# Altium schematic sheet Motor.SchDoc
size A
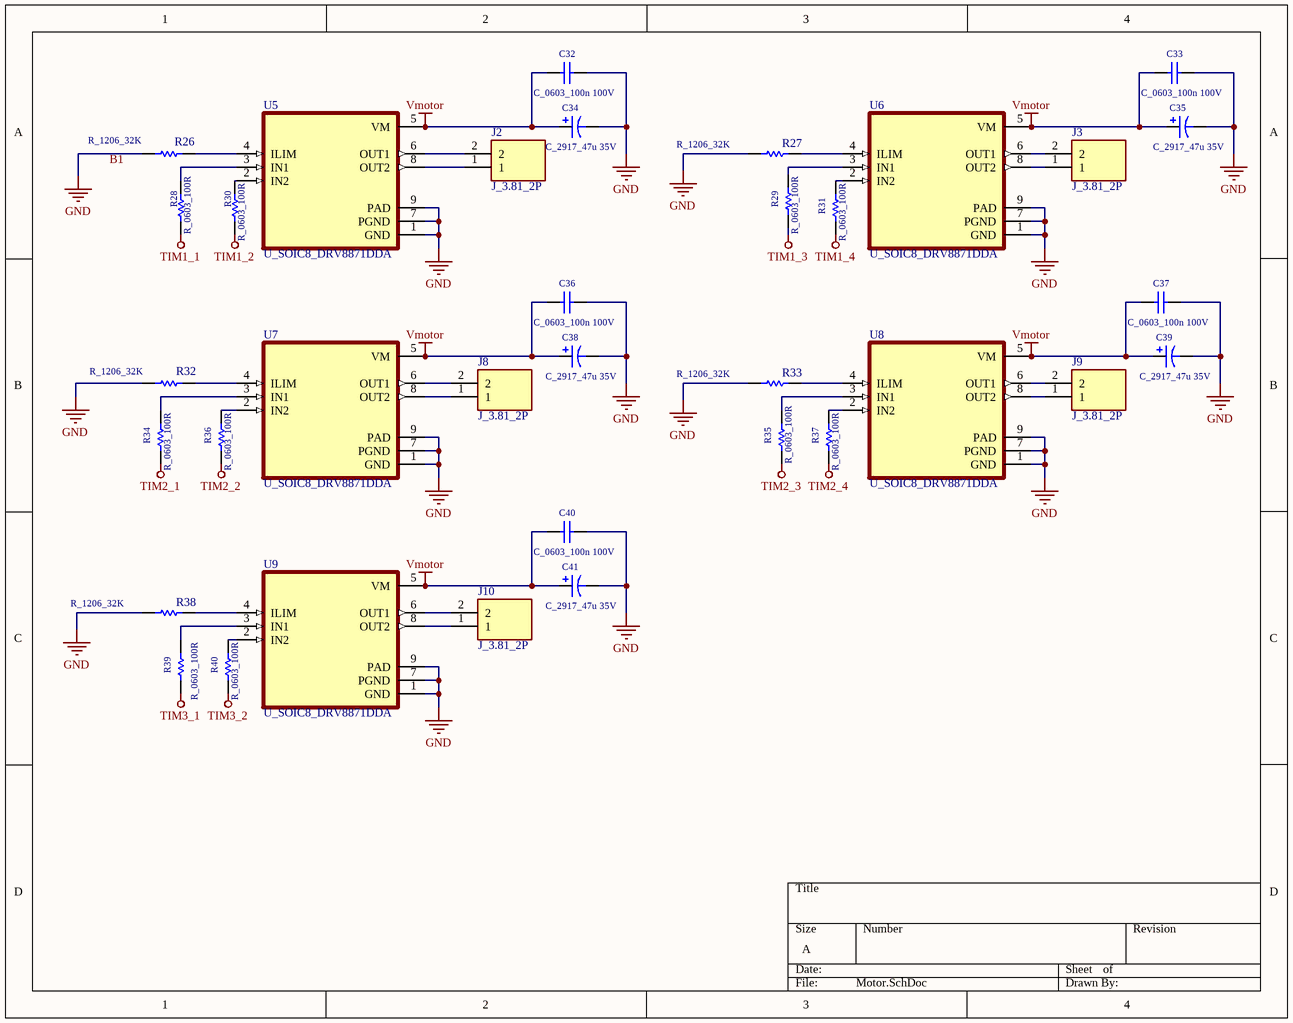
[diagram p0: Motor.SchDoc]

## Parts
C32  C_0603_100n 100V  [CAP 0603]
C33  C_0603_100n 100V  [CAP 0603]
C34  C_2917_47u 35V  [CAP 2917 TAN]
C35  C_2917_47u 35V  [CAP 2917 TAN]
C36  C_0603_100n 100V  [CAP 0603]
C37  C_0603_100n 100V  [CAP 0603]
C38  C_2917_47u 35V  [CAP 2917 TAN]
C39  C_2917_47u 35V  [CAP 2917 TAN]
C40  C_0603_100n 100V  [CAP 0603]
C41  C_2917_47u 35V  [CAP 2917 TAN]
J2  J_3.81_2P  [2 Pin PCB TB 3.81]
J3  J_3.81_2P  [2 Pin PCB TB 3.81]
J8  J_3.81_2P  [2 Pin PCB TB 3.81]
J9  J_3.81_2P  [2 Pin PCB TB 3.81]
J10  J_3.81_2P  [2 Pin PCB TB 3.81]
R26  R_1206_32K  [RES 1206]
R27  R_1206_32K  [RES 1206]
R28  R_0603_100R  [RES 0603]
R29  R_0603_100R  [RES 0603]
R30  R_0603_100R  [RES 0603]
R31  R_0603_100R  [RES 0603]
R32  R_1206_32K  [RES 1206]
R33  R_1206_32K  [RES 1206]
R34  R_0603_100R  [RES 0603]
R35  R_0603_100R  [RES 0603]
R36  R_0603_100R  [RES 0603]
R37  R_0603_100R  [RES 0603]
R38  R_1206_32K  [RES 1206]
R39  R_0603_100R  [RES 0603]
R40  R_0603_100R  [RES 0603]
U5  U_SOIC8_DRV8871DDA  [SOIC8]
U6  U_SOIC8_DRV8871DDA  [SOIC8]
U7  U_SOIC8_DRV8871DDA  [SOIC8]
U8  U_SOIC8_DRV8871DDA  [SOIC8]
U9  U_SOIC8_DRV8871DDA  [SOIC8]

## Nets
GND: C32.2 C33.2 C34.2 C35.2 C36.2 C37.2 C38.2 C39.2 C40.2 C41.2 R26.1 R27.1 R32.1 R33.1 R38.1 U5.1(GND) U5.7(PGND) U5.9(PAD) U6.1(GND) U6.7(PGND) U6.9(PAD) U7.1(GND) U7.7(PGND) U7.9(PAD) U8.1(GND) U8.7(PGND) U8.9(PAD) U9.1(GND) U9.7(PGND) U9.9(PAD)
TIM1_1: R28.1
TIM1_2: R30.1
TIM1_3: R29.1
TIM1_4: R31.1
TIM2_1: R34.1
TIM2_2: R36.1
TIM2_3: R35.1
TIM2_4: R37.1
TIM3_1: R39.1
TIM3_2: R40.1
Vmotor: C32.1 C33.1 C34.1 C35.1 C36.1 C37.1 C38.1 C39.1 C40.1 C41.1 U5.5(VM) U6.5(VM) U7.5(VM) U8.5(VM) U9.5(VM)
NetJ2_1: J2.1 U5.8(OUT2)
NetJ2_2: J2.2 U5.6(OUT1)
NetJ3_1: J3.1 U6.8(OUT2)
NetJ3_2: J3.2 U6.6(OUT1)
NetJ8_1: J8.1 U7.8(OUT2)
NetJ8_2: J8.2 U7.6(OUT1)
NetJ9_1: J9.1 U8.8(OUT2)
NetJ9_2: J9.2 U8.6(OUT1)
NetJ10_1: J10.1 U9.8(OUT2)
NetJ10_2: J10.2 U9.6(OUT1)
NetR26_2: R26.2 U5.4(ILIM)
NetR27_2: R27.2 U6.4(ILIM)
NetR28_2: R28.2 U5.3(IN1)
NetR29_2: R29.2 U6.3(IN1)
NetR30_2: R30.2 U5.2(IN2)
NetR31_2: R31.2 U6.2(IN2)
NetR32_2: R32.2 U7.4(ILIM)
NetR33_2: R33.2 U8.4(ILIM)
NetR34_2: R34.2 U7.3(IN1)
NetR35_2: R35.2 U8.3(IN1)
NetR36_2: R36.2 U7.2(IN2)
NetR37_2: R37.2 U8.2(IN2)
NetR38_2: R38.2 U9.4(ILIM)
NetR39_2: R39.2 U9.3(IN1)
NetR40_2: R40.2 U9.2(IN2)

## Notes on the sheet
- Labels drawn without touching a wire or pin: B1

## Library data of the parts
C32 C33 C36 C37 C40 = Cap: Capacitor; Published: 8-Jun-2000; LatestRevisionDate: 17-Jul-2002; LatestRevisionNote: Re-released for DXP Platform.; Publisher: Altium Limited
C34 C35 C38 C39 C41 = Cap Tantalium: Capacitor Tantalium; Published: 8-Jun-2000; LatestRevisionDate: 17-Jul-2002; LatestRevisionNote: Re-released for DXP Platform.; Publisher: Altium Limited
J2 J3 J8-J10 = 2 Pin PCB Terminal Block: MF: CUI Devices; MP: TBP02R1-381-02BE; CUI_purchase_URL: https://www.cuidevices.com/product/interconnect/connectors/terminal-blocks/tbp02r1-381-series?utm_source=snapeda.com&utm_medium=referral&utm_campaign=snapedaBOM; Purchase-URL: https://pricing.snapeda.com/search/part/TBP02R1-381-02BE/?ref=eda; Price: None; SnapEDA_Link: https://www.snapeda.com/parts/TBP02R1-381-02BE/CUI+Devices/view-part/?ref=snap; Check_prices: https://www.snapeda.com/parts/TBP02R1-381-02BE/CUI+Devices/view-part/?ref=eda; Package: None; Availability: In Stock; Value: *
R26-R40 = Res: Resistor; Published: 8-Jun-2000; LatestRevisionDate: 17-Jul-2002; LatestRevisionNote: Re-released for DXP Platform.; Publisher: Altium Limited
U5-U9 = DRV8871DDA: 45-V, 3.6-A H-bridge motor driver with integrated current sensing 8-SO PowerPAD -40 to 125; MF: Texas Instruments; Mouser-Purchase-URL: https://snapeda.com/shop?store=Mouser&id=547750; SnapEDA_Link: https://www.snapeda.com/parts/DRV8871DDA/Texas%20Instruments/view-part/547750/?ref=snap; DigiKey-Purchase-URL: https://snapeda.com/shop?store=DigiKey&id=547750; Arrow_Electronics-Purchase-URL: https://snapeda.com/shop?store=Arrow+Electronics&id=547750; MP: DRV8871DDA; Texas_Instruments-Purchase-URL: https://snapeda.com/shop?store=Texas+Instruments&id=547750; Availability: Good; Price: None; Value: *; Package: HSOIC-8 Texas Instruments; BuyPart: https://www.snapeda.com/parts/DRV8871DDA/Texas%20Instruments/view-part/547750/?ref=eda